# Altium schematic sheet BalCircuit.SchDoc
size A; SheetNumber: 2
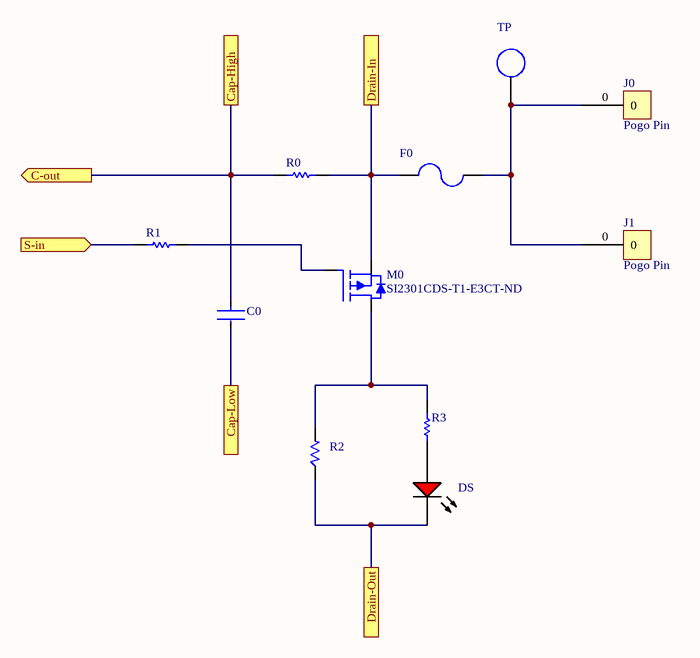
[diagram p0: BalCircuit.SchDoc]

## Parts
C0  CL21B103KCANNNC  [FP-CL21-IPC_A]  (value not drawn)
DS  19-217/R6C-AL1M2VY/3T  [EVRL-0603-2_V]  (value not drawn)
F0  3404.0112.11  [OMT125]  (value not drawn)
J0  Pogo Pin  [0852-0]
J1  Pogo Pin  [0852-0]
M0  Supplier Part Number 1: SI2301CDS-T1-E3CT-ND  [SOT23_527AG_ONS]  (hidden comment: SI2301CDS-T1-E3)
R0  RK73B2ATTD101J  [RESC2013X60X30NL20T20]  (value not drawn)
R1  RC0805JR-073K3L  [RESC0805(2012)_M]  (value not drawn)
R2  352116RFT  [FP-ERJ1TR-IPC_A]  (value not drawn)
R3  0603WAF750JT5E  [FP-AC0603-0_55-MFG]  (value not drawn)
TP  N/A  [PCB Test Point]  (value not drawn)

## Ports
C-out (out), Cap-High, Cap-Low, Drain-In, Drain-Out, S-in (in)

## Nets
C-out: C0.1 R0.1 ; port C-out, port Cap-High
Cap-Low: C0.2 ; port Cap-Low
Drain-In: F0.1 M0.2 R0.2 ; port Drain-In
Drain-Out: DS.2(K) R2.1 ; port Drain-Out
S-in: R1.1 ; port S-in
NetDS_1: DS.1(A) R3.2
NetF0_2: F0.2 J0.0 J1.0 TP.1
NetM0_1: M0.1 R1.2
NetM0_3: M0.3 R2.2 R3.1

## Library data of the parts
C0 = CMP-13271-003077-1: CL21 Series 0805 10nF 100V ±10% Tolerance X7R Multilayer Ceramic Chip Capacitor; Voltage: 100V; Contact Plating: Tin; Height: 0.65mm; Thickness: 0.03inch; Min Operating Temperature: -55°C; Capacitance: 10nF; Length: 2mm; Max Operating Temperature: 125°C; Case Code (Imperial): 0805; Radiation Hardening: No; Dielectric: X7R; Material: Ceramic; Depth: 1.25mm; Voltage Rating: 100V; Case/Package: 0805; Tolerance: 10%; Package Quantity: 1; Width: 0.049inch; Mount: Surface Mount; Case Code (Metric): 2012; Packaging: Tape and Reel
DS = CMP-2100-03578-1: Chip LED, Red, 5 V, 25 mA, -40 to 85 degC, 2-Pin SMD (0603), RoHS, Tape and Reel; Manufacturer: Everlight Electronics; Forward Voltage: 2.2V; Lens Style: Clear; Package Reference: 0603; Case/Package: 0603; RoHSCompliant: false; Package Description: 2-Pin Surface Mount Device, Body 1.6 x 0.8 mm; Colour: Red; Lead Free: LeadFree; Datasheet URL: https://datasheet.ciiva.com/4688/el-19-217-r6c-al1m2vy-3tpdf-187026-4688713.pdf; Manufacturer URL: http://www.everlight.com/; Datasheet Version: Rev. 1, 01/2005
F0 = OMT125: SCHURTER   3404.0112.11   FUSE, 1/2A, 125VDC, SMT; Manufacturer Part Number 1: 3404.0114.11; Body Material: Thermoplastic; Current Rating: 1A; Voltage Rating: 125V; Power Dissipation: 88mW; Fuse Type: Board Mount (Cartridge Style Excluded); Fuse Size: 7.4 X 3.1mm; Blow Characteristic: TIME DELAY; Approvals: cURus,cULus,UL; Supplier 1: Digi-Key; Manufacturer 1: Schurter; RoHS: Yes; Category: Fuses; Stock 1: 1439; Pricing 1: 1=0.67000, 50=0.56400, 100=0.43100, 500=0.42300, 1000=0.38171 (USD); Mount: Surface Mount,PCB; Case/Package: SMD/SMT; Number of Pins: 2; Contact Material: Copper Alloy; Contact Plating: Tin; Housing Material: Thermoplastic; Terminal Material: Tin; Min Operating Temperature: -55°C; Max Operating Temperature: 85°C; Package Quantity: 100; Voltage Rating (AC): 125V; Voltage Rating (DC): 125V; Packaging: Bag; Max Voltage Rating (DC): 125V; Max Voltage Rating (AC): 125V; Current: 1A; Termination: SMD/SMT; Fuse Current: 1A; Series: OMT 125; Length: 7.4mm; Width: 0.122inch; Height: 0.102inch; Depth: 3.1mm; Radiation Hardening: No; REACH SVHC: No SVHC; Flammability Rating: UL94 V-0; RoHS Compliant: Yes; ComponentLink1URL: https://datasheet.ciiva.com/4486/typ-omt-125-14932-4486467.pdf?src-supplier=Mouser; ComponentLink1Description: https://datasheet.ciiva.com/4486/typ-omt-125-14932-4486467.pdf?src-supplier=Mouser; ComponentLink2URL: https://datasheet.ciiva.com/26876/getdatasheetpartid-627585-26876503.pdf?src-supplier=Verical; ComponentLink2Description: https://datasheet.ciiva.com/26876/getdatasheetpartid-627585-26876503.pdf?src-supplier=Verical; ComponentLink3URL: https://datasheet.ciiva.com/17402/typ-omt-125-17402981.pdf?src-supplier=Avnet+Europe; ComponentLink3Description: https://datasheet.ciiva.com/17402/typ-omt-125-17402981.pdf?src-supplier=Avnet+Europe; ComponentLink4URL: https://datasheet.ciiva.com/1549/typ-omt-125-1549883.pdf?src-supplier=Element14; ComponentLink4Description: https://datasheet.ciiva.com/1549/typ-omt-125-1549883.pdf?src-supplier=Element14; ComponentLink5URL: https://datasheet.ciiva.com/8264/typ-omt-125-8264396.pdf?src-supplier=Avnet; ComponentLink5Description: https://datasheet.ciiva.com/8264/typ-omt-125-8264396.pdf?src-supplier=Avnet
J0 J1 = 0852-0-15-20-83-14-11-0: 90 thou stroke
M0 = SI2301CDS-T1-E3: Trans Mosfet P-ch 20V 3.1A 3-PIN SOT-23 T/r / Mosfet P-ch 20V 3.1A SOT23-3; Manufacturer 1: Vishay Siliconix; Rds On Max: 112mR; Input Capacitance: 405pF; Rise Time: 35ns; Max Power Dissipation: 1.6W; Gate to Source Voltage (Vgs): 8V; Turn-Off Delay Time: 30ns; Threshold Voltage: -400mV; Turn-On Delay Time: 11ns; Element Configuration: Single; Drain to Source Breakdown Voltage: -20V; Number of Channels: 1; Polarity: P-CHANNEL; Supplier 1: Digi-Key; Manufacturer Part Number 1: SI2301CDS-T1-E3; RoHS: Yes; Category: MOSFETs; Stock 1: 82098; Pricing 1: 1=0.51000, 10=0.38800, 100=0.24160, 500=0.16530, 1000=0.12716 (USD); Mount: Surface Mount; Case/Package: SOT-23-3; Number of Pins: 3; Weight: 0.050717oz; Min Operating Temperature: -55°C; Max Operating Temperature: 150°C; Package Quantity: 1; Packaging: Tape and Reel; Drain to Source Voltage (Vdss): 20V; Continuous Drain Current (ID): 3.1A; Drain to Source Resistance: 112mR; Fall Time: 35ns; Series: TrenchFET®; Length: 3.04mm; Width: 1.4mm; Height: 1.02mm; Radiation Hardening: No; REACH SVHC: Unknown; Lead Free: Lead Free; RoHS Compliant: Yes; ComponentLink1URL: https://datasheet.ciiva.com/4442/si2301cd-244544-4442236.pdf?src-supplier=Mouser; ComponentLink1Description: https://datasheet.ciiva.com/4442/si2301cd-244544-4442236.pdf?src-supplier=Mouser; ComponentLink2URL: https://datasheet.ciiva.com/22652/1719653-22652314.pdf?src-supplier=Element14; ComponentLink2Description: https://datasheet.ciiva.com/22652/1719653-22652314.pdf?src-supplier=Element14; ComponentLink3URL: https://datasheet.ciiva.com/2957/si2301cd-2957335.pdf?src-supplier=Digi-Key; ComponentLink3Description: https://datasheet.ciiva.com/2957/si2301cd-2957335.pdf?src-supplier=Digi-Key; ComponentLink4URL: https://datasheet.ciiva.com/2957/si2301cd-2957336.pdf?src-supplier=Digi-Key; ComponentLink4Description: https://datasheet.ciiva.com/2957/si2301cd-2957336.pdf?src-supplier=Digi-Key; ComponentLink5URL: https://datasheet.ciiva.com/11160/si2301cd-11160982.pdf?src-supplier=Avnet; ComponentLink5Description: https://datasheet.ciiva.com/11160/si2301cd-11160982.pdf?src-supplier=Avnet; ComponentLink6URL: https://datasheet.ciiva.com/26137/si2301cd-26137818.pdf?src-supplier=Avnet+Europe; ComponentLink6Description: https://datasheet.ciiva.com/26137/si2301cd-26137818.pdf?src-supplier=Avnet+Europe
R0 = CMP-2001-04655-1: 100R 1/4W 5% 0805; Manufacturer: KOA Speer; Part Number: RK73B2ATTD101J
R1 = CMP-1013-00086-1: 3K3 0.125W 5% 0805 (2012 Metric)  SMD; Case-Metric: 2012; Case-EIA: 0805; Value: 3300.00 Ohm; Tolerance: 5 %; Technology: SMT; Power: 0.125 W
R2 = 352116RFT: Res Thick Film 2512 16 Ohm 1% 2W ±100ppm/C Pad SMD Automotive T/R; Manufacturer 1: TE Connectivity; Resistance: 16R; Temperature Coefficient: 100ppm/°C; Voltage Rating: 250V; Number of Resistors: 1; Supplier 1: Digi-Key; Manufacturer Part Number 1: 352116RFT; RoHS: Yes; Category: Chip SMD Resistors; Stock 1: 79023; Pricing 1: 1=0.83000, 10=0.61200, 100=0.35610, 1000=0.19972 (USD); Mount: Surface Mount; Case/Package: 2512; Case Code (Metric): 6432; Case Code (Imperial): 2512; Min Operating Temperature: -55°C; Max Operating Temperature: 155°C; Tolerance: 1%; Packaging: Tape and Reel; Resistor Type: Thick Film,Power resistor; Number of Terminations: 2; Power Rating: 2W; Termination: Solder; Voltage Rating (DC): 250V; Technology: THICK FILM; Series: 3521; Resistance Tolerance: 1%; Length: 6.3mm; Height: 0.55mm; Depth: 3.2mm; RoHS Compliant: Yes; REACH SVHC: No SVHC; ELV: Compliant; ComponentLink1URL: https://datasheet.ciiva.com/25610/0900766b81096b90-25610624.pdf?src-supplier=RSComponents; ComponentLink1Description: https://datasheet.ciiva.com/25610/0900766b81096b90-25610624.pdf?src-supplier=RSComponents; ComponentLink2URL: https://datasheet.ciiva.com/46391/1610601-46391497.pdf?src-supplier=Element14; ComponentLink2Description: https://datasheet.ciiva.com/46391/1610601-46391497.pdf?src-supplier=Element14; ComponentLink3URL: https://datasheet.ciiva.com/7657/1610601-7657546.pdf?src-supplier=Element14; ComponentLink3Description: https://datasheet.ciiva.com/7657/1610601-7657546.pdf?src-supplier=Element14; Supplier Part Number 1: A115989CT-ND
R3 = 0603WAF750JT5E: ±1% ±200ppm/℃ 75Ω 0.1W 0603 Chip Resistor - Surface Mount ROHS; Manufacturer 1: Panasonic; Manufacturer Part Number 1: ERJ-PB3B1002V; Resistance: 10kR; Tolerance: 0.1%; Max Power Dissipation: 200mW; Temperature Coefficient: 50ppm/°C; RoHS: Yes; Category: Chip SMD Resistors; Stock 1: 3; Pricing 1: 1=0.23000, 10=0.19100, 25=0.13920, 50=0.10100, 100=0.07480, 250=0.05744, 500=0.04524, 1000=0.03132 (USD); Case/Package: 0603; Case Code (Metric): 1608; Case Code (Imperial): 0603; Min Operating Temperature: -55°C; Max Operating Temperature: 155°C; Packaging: Tape and Reel; Resistor Type: Thick Film; Number of Terminations: 2; Features: Automotive AEC-Q200; Length: 0.063inch; Width: 0.032inch; Height - Seated (Max): 0.022inch; ComponentLink1URL: https://industrial.panasonic.com/sa/system/files/data/download/catalog/id_fixed-resistors_e_2.pdf?src-supplier=Digi-Key; ComponentLink1Description: https://industrial.panasonic.com/sa/system/files/data/download/catalog/id_fixed-resistors_e_2.pdf?src-supplier=Digi-Key; ComponentLink2URL: https://industrial.panasonic.com/cdbs/www-data/pdf/RDM0000/DMM0000COL5.pdf?src-supplier=Digi-Key; ComponentLink2Description: https://industrial.panasonic.com/cdbs/www-data/pdf/RDM0000/DMM0000COL5.pdf?src-supplier=Digi-Key
TP = PCB Test Point: Manufacturer: RIT Racing; TargetLibrary: RITRacing-Connectors; PartNumber: N/A; Publisher: T.Tallo; Published: 22Oct2016; Status: Active; ComponentLink1URL: http://www.mouser.com/ds/2/215/005-5009-743680.pdf; ComponentLink1Description: Datasheet